# Altium schematic sheet STM32.SchDoc
size A4; SheetNumber: 2; SheetTotal: 7
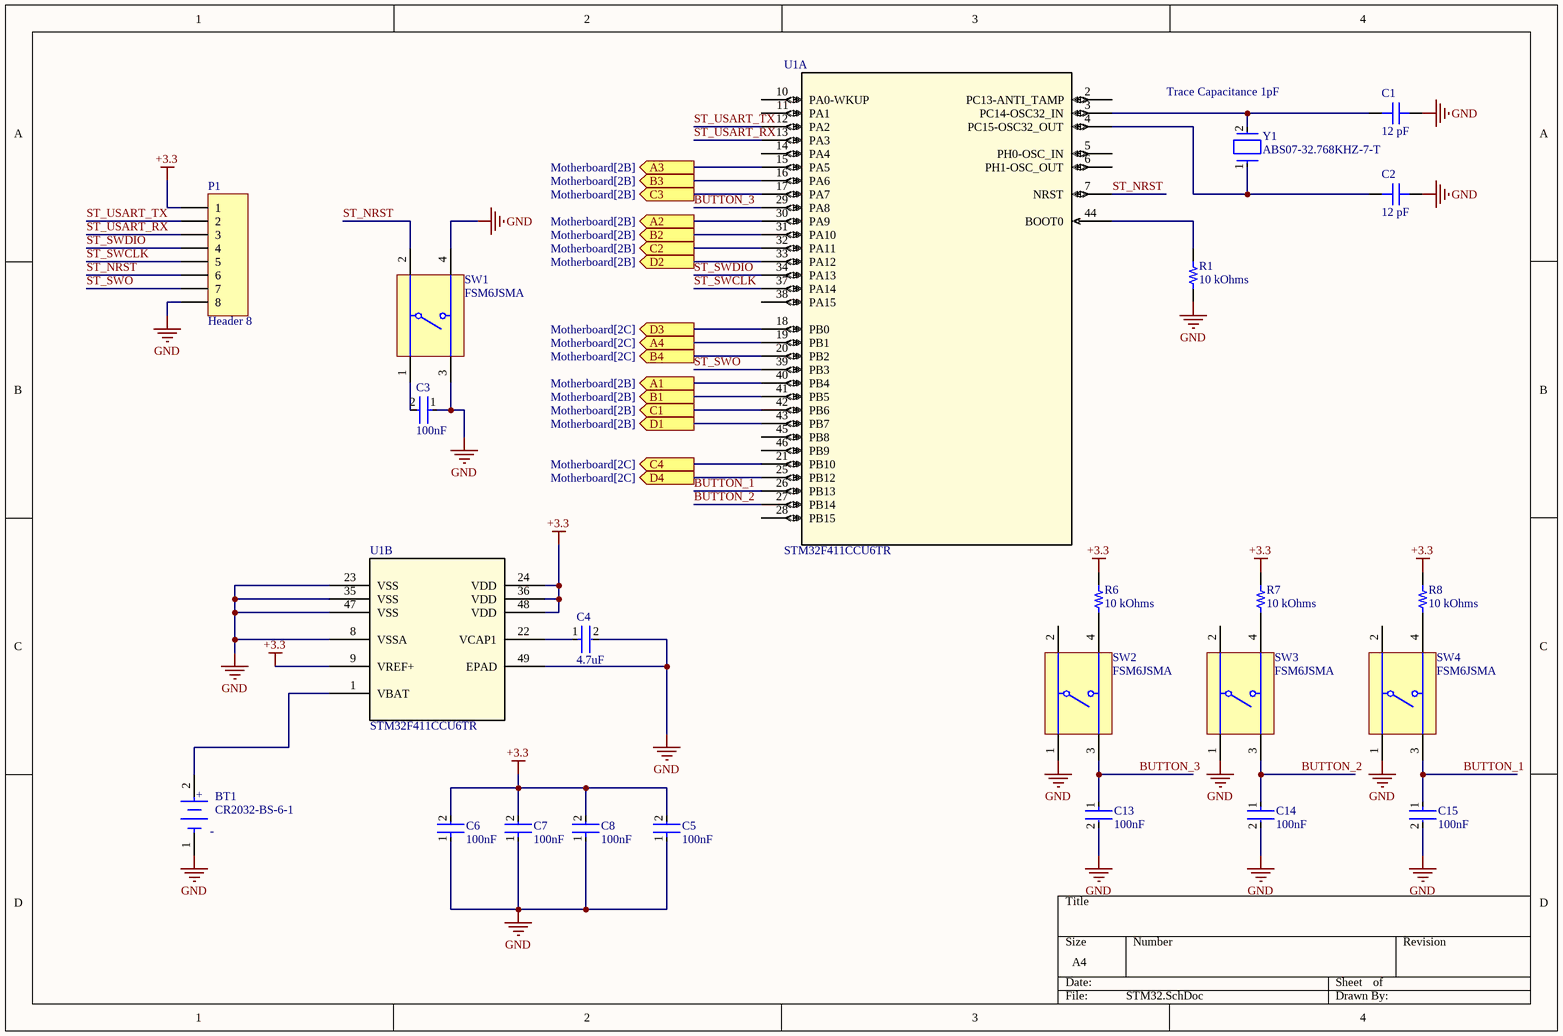
[diagram p0: STM32.SchDoc]

## Parts
BT1  CR2032-BS-6-1  [FP-BU2032SM-BT-GTR-MFG]
C1  12 pF  [CAP 0201_0603]
C2  12 pF  [CAP 0201_0603]
C3  100nF  [FP-C1005-050-0_15-MFG]
C4  4.7uF  [FP-C1005-050-0_15-MFG]
C5  100nF  [FP-C1005-050-0_15-MFG]
C6  100nF  [FP-C1005-050-0_15-MFG]
C7  100nF  [FP-C1005-050-0_15-MFG]
C8  100nF  [FP-C1005-050-0_15-MFG]
C13  100nF  [FP-C1005-050-0_15-MFG]
C14  100nF  [FP-C1005-050-0_15-MFG]
C15  100nF  [FP-C1005-050-0_15-MFG]
P1  Header 8  [HDR1X8]
R1  10 kOhms  [RES 0402_1005]
R6  10 kOhms  [RES 0402_1005]
R7  10 kOhms  [RES 0402_1005]
R8  10 kOhms  [RES 0402_1005]
SW1  FSM6JSMA  [TECO-FSM6JSMA_V]
SW2  FSM6JSMA  [TECO-FSM6JSMA_V]
SW3  FSM6JSMA  [TECO-FSM6JSMA_V]
SW4  FSM6JSMA  [TECO-FSM6JSMA_V]
U1  STM32F411CCU6TR  [UFQFPN-48_7X7X0P55MM]  (parts A,B of 2)
Y1  ABS07-32.768KHZ-7-T  [FP-ABS07-MFG]

## Ports
A1 (out, see Motherboard[2B]), A2 (out, see Motherboard[2B]), A3 (out, see Motherboard[2B]), A4 (out, see Motherboard[2C]), B1 (out, see Motherboard[2B]), B2 (out, see Motherboard[2B]), B3 (out, see Motherboard[2B]), B4 (out, see Motherboard[2C]), C1 (out, see Motherboard[2B]), C2 (out, see Motherboard[2B]), C3 (out, see Motherboard[2B]), C4 (out, see Motherboard[2C]), D1 (out, see Motherboard[2B]), D2 (out, see Motherboard[2B]), D3 (out, see Motherboard[2C]), D4 (out, see Motherboard[2C])

## Nets
+3.3: C5.2 C6.2 C7.2 C8.2 P1.1 R6.2 R7.2 R8.2 U1.9(VREF+) U1.24(VDD) U1.36(VDD) U1.48(VDD)
GND: BT1.1(C) C1.2 C2.2 C3.1 C4.2 C5.1 C6.1 C7.1 C8.1 C13.2 C14.2 C15.2 P1.8 R1.1 SW1.3 SW1.4 SW2.1 SW3.1 SW4.1 U1.8(VSSA) U1.23(VSS) U1.35(VSS) U1.47(VSS) U1.49(EPAD)
A1: U1.40(PB4) ; port A1
A2: U1.30(PA9) ; port A2
A3: U1.15(PA5) ; port A3
A4: U1.19(PB1) ; port A4
B1: U1.41(PB5) ; port B1
B2: U1.31(PA10) ; port B2
B3: U1.16(PA6) ; port B3
B4: U1.20(PB2) ; port B4
BUTTON_1: C15.1 SW4.3 U1.26(PB13)
BUTTON_2: C14.1 SW3.3 U1.27(PB14)
BUTTON_3: C13.1 SW2.3 U1.29(PA8)
C1: U1.42(PB6) ; port C1
C2: U1.32(PA11) ; port C2
C3: U1.17(PA7) ; port C3
C4: U1.21(PB10) ; port C4
D1: U1.43(PB7) ; port D1
D2: U1.33(PA12) ; port D2
D3: U1.18(PB0) ; port D3
D4: U1.25(PB12) ; port D4
ST_NRST: P1.6 SW1.2 U1.7(NRST)
ST_SWCLK: P1.5 U1.37(PA14)
ST_SWDIO: P1.4 U1.34(PA13)
ST_SWO: P1.7 U1.39(PB3)
ST_USART_RX: P1.3 U1.13(PA3)
ST_USART_TX: P1.2 U1.12(PA2)
NetBT1_2: BT1.2(A) U1.1(VBAT)
NetC1_1: C1.1 U1.3(PC14-OSC32_IN) Y1.2
NetC2_1: C2.1 U1.4(PC15-OSC32_OUT) Y1.1
NetC3_2: C3.2 SW1.1
NetC4_1: C4.1 U1.22(VCAP1)
NetR1_2: R1.2 U1.44(BOOT0)
NetR6_1: R6.1 SW2.4
NetR7_1: R7.1 SW3.4
NetR8_1: R8.1 SW4.4

Not connected (* = marked no-connect by the designer): SW2 2; SW3 2; SW4 2; U1 2(PC13-ANTI_TAMP) 5(PH0-OSC_IN) 6(PH1-OSC_OUT) 10(PA0-WKUP) 11(PA1) 14(PA4) 28(PB15) 38(PA15) 45(PB8) 46(PB9)

## Notes on the sheet
- (near Y1) Trace Capacitance 1pF
- (in symbol CMP-136216-000002-1) +; -

## Library data of the parts
BT1 = CMP-136216-000002-1: Number of Cells: 1; Termination: SMD/SMT; Mount: Surface Mount; Max Operating Temperature: 280°C; Min Operating Temperature: -40°C; Package Quantity: 400; Case/Package: SMD/SMT
C1 C2 = C0201C100J3GAC7867: CAP CER 10PF 25V C0G/NP0 0201; manufacturer: KEMET; Temperature Coefficient: C0G, NP0; Tolerance: ±5%; Part Number: C0201C100J3GAC7867; Value: 12 pF; Applications: General Purpose; Capacitance: 12 pF; componentlink1description: Datasheet; componentlink1url: https://api.kemet.com/component-edge/download/datasheet/C0201C100J3GAC7867.pdf; componentlink2description: DigiKey Link; componentlink2url: https://www.digikey.com/en/products/detail/kemet/C0201C100J3GAC7867/7381972; Device Package: 0201 (0603 Metric); Features: Low ESL; lastupdated: 13.03.2023 19:01:22; Lifecycle Status: Active; Minimum Order: 1; Mounting Type: Surface Mount, MLCC; Operating Temperature: -55°C ~ 125°C; Package / Case: 0201 (0603 Metric); packaging: TapeAndReel; partid: 4; Part Status: Active; price: 0.02; series: SMD Comm C0G; Size / Dimension: 0.024" L x 0.012" W (0.60mm x 0.30mm); Supplier 1: DigiKey; Supplier Part Number 1: 399-14856-1-ND; Thickness (Max): 0.013" (0.33mm); Voltage - Rated: 25V
C3 C5-C8 C13-C15 = CMP-2000-05438-2: CAP CER 100nF 10V X5R 0402; Dielectric Material: Ceramic; Tolerance: 20%; Capacitance: 4.7uF; RoHS Compliant: Yes; Lead Free: Lead Free; Max Operating Temperature: 85°C; Case Code (Metric): 1005; Dielectric: X5R; Height: 0.5mm; Length: 1mm; Case Code (Imperial): 0402; Width: 0.02inch; Mount: Surface Mount; Case/Package: 0402; Min Operating Temperature: -55°C; Radiation Hardening: No; Resistor Type: Ceramic; Construction: Flat; REACH SVHC: No SVHC; Voltage Rating (DC): 10V; Voltage Rating: 10V; Package Quantity: 1; Termination: SMD/SMT; Thickness: 500um; Voltage: 10V; Packaging: Tape and Reel; Depth: 0.5mm; Weight: 2.3E-05oz; Series: C
C4 = CMP-2000-05438-2: CAP CER 4.7UF 10V X5R 0402; Dielectric Material: Ceramic; Tolerance: 20%; RoHS Compliant: Yes; Lead Free: Lead Free; Max Operating Temperature: 85°C; Case Code (Metric): 1005; Dielectric: X5R; Height: 0.5mm; Length: 1mm; Case Code (Imperial): 0402; Width: 0.02inch; Mount: Surface Mount; Case/Package: 0402; Min Operating Temperature: -55°C; Radiation Hardening: No; Resistor Type: Ceramic; Construction: Flat; REACH SVHC: No SVHC; Voltage Rating (DC): 10V; Voltage Rating: 10V; Package Quantity: 1; Termination: SMD/SMT; Thickness: 500um; Capacitance: 4.7uF; Voltage: 10V; Packaging: Tape and Reel; Depth: 0.5mm; Weight: 2.3E-05oz; Series: C
P1 = Header 8: Header, 8-Pin; LatestRevisionDate: 17-Jul-2002; LatestRevisionNote: Re-released for DXP Platform.; Publisher: Altium Limited
R1 R6-R8 = TNPW040210K0BETD: RES 10K OHM 1% 1/16W 0402; Manufacturer: Vishay Dale; Power (Watts): 0.063W, 1/16W; Temperature Coefficient: ±25ppm/°C; Tolerance: ±0.1%; Part Number: TNPW040210K0BETD; Value: 10 kOhms; ComponentLink1Description: Datasheet; ComponentLink1URL: http://www.vishay.com/docs/31006/tnpw.pdf; ComponentLink2Description: DigiKey Link; ComponentLink2URL: https://www.digikey.com/en/products/detail/vishay-dale/TNPW040210K0BETD/1613222; Composition: Thin Film; Device Package: 0402 (1005 Metric); Features: Military; Height - Seated (Max): 0.016" (0.40mm); LastUpdated: 13.03.2023 19:23:30; Lifecycle Status: Active; Minimum Order: 1; Number of Terminations: 2; Operating Temperature: -55°C ~ 125°C; Package / Case: 0402 (1005 Metric); Packaging: TapeAndReel; PartId: 3021; Part Status: Active; Price: 0.25; Resistance: 10 kOhms; Series: TNPW; Size / Dimension: 0.039" L x 0.020" W (1.00mm x 0.50mm); Supplier 1: DigiKey; Supplier Part Number 1: 541-3559-1-ND; Supplier Device Package: 0402
SW1-SW4 = CMP-2000-07503-1: Switch, SPST, 24 V, -35 to 85 degC, 4-Pin SMD, RoHS, Tape and Reel; Manufacturer: TE Connectivity; Electrical Life: 100000Cycles; Voltage Rating (DC): 24V; Contact Resistance: 100mOhm; Case\/Package: SMD/SMT; Actuator Length: 3.4mm; Contact Current Rating: 50mA; Operating Force: 1.57N; Max Voltage Rating (DC): 12V; Illumination Type: Illuminated; Actuator Material: Polyamide; Switch Travel: 0.25mm; Contact Plating: Silver; Mount: SurfaceMount; Contact Material: CopperAlloy; RoHSCompliant: true; Width: 6mm; Package Reference: FSM6JSMA; Manufacturer URL: http://www.te.com/; Min Operating Temperature: -35degC; REACH SVHC: Unknown; Datasheet Version: Rev. V, 02/2015; Package Quantity: 750; Voltage Rating: 24V; Termination: GullWing; Mechanical Life: 100000Cycles; Mounting Technology: SurfaceMount; Insulation Resistance: 100MOhm; Packaging: LoosePiece; Package Description: 4-Pin Surface Mount Device, Body 6 x 6 mm, Pitch 4.5 mm; Orientation: Straight; Max Operating Temperature: 85degC; Length: 6mm; Current Rating: 50mA; Datasheet URL: http://www.te.com/commerce/DocumentDelivery/DDEController?Action=showdoc&DocId=Customer+Drawing%7F2-1437565-7%7FV%7Fpdf%7FEnglish%7FENG_CD_2-1437565-7_V.pdf%7F4-1437565-9; Lead Free: LeadFree; ELV: Compliant; Throw Configuration: SPST
U1 = STM32F411CCU6TR: No Description Available; Mfr_Name: STMicroelectronics; Copyright: Copyright (C) 2023 Ultra Librarian. All rights reserved.; Manufacturer_Part_Number: STM32F411CCU6TR; RefDes: RefDes; Type: DEV
Y1 = CMP-27762-013661-2: Crystal 32.768kHz ±20ppm (Tol) 9pF FUND 70kΩ 2-Pin CSMD T/R; Insulation Resistance: 500MR; Series Resistance: 70kR; Packaging: Tape and Reel; Length: 3.2mm; Max Operating Temperature: 85°C; Mount: Surface Mount; Height: 0.9mm; Number of Pins: 2; Depth: 1.5mm; Series: ABS07; REACH SVHC: No SVHC; Tolerance: 20ppm; Radiation Hardening: No; Case/Package: CSMD; Package Quantity: 3000; Termination: SMD/SMT; Operating Frequency: 32.768 kHz; Width: 1.5mm; Load Capacitance: 9pF; Lead Free: Lead Free; Frequency Tolerance: 20ppm; Frequency Stability: 20ppm; Frequency: 32.768kHz; ESR (Equivalent Series Resistance): 70kR; RoHS Compliant: Yes; Min Operating Temperature: -40°C